# Altium schematic sheet 1.1.2_Interface_board_Power_Supply.SchDoc
size A4; DocumentNumber: 4; SheetNumber: 4; SheetTotal: 14
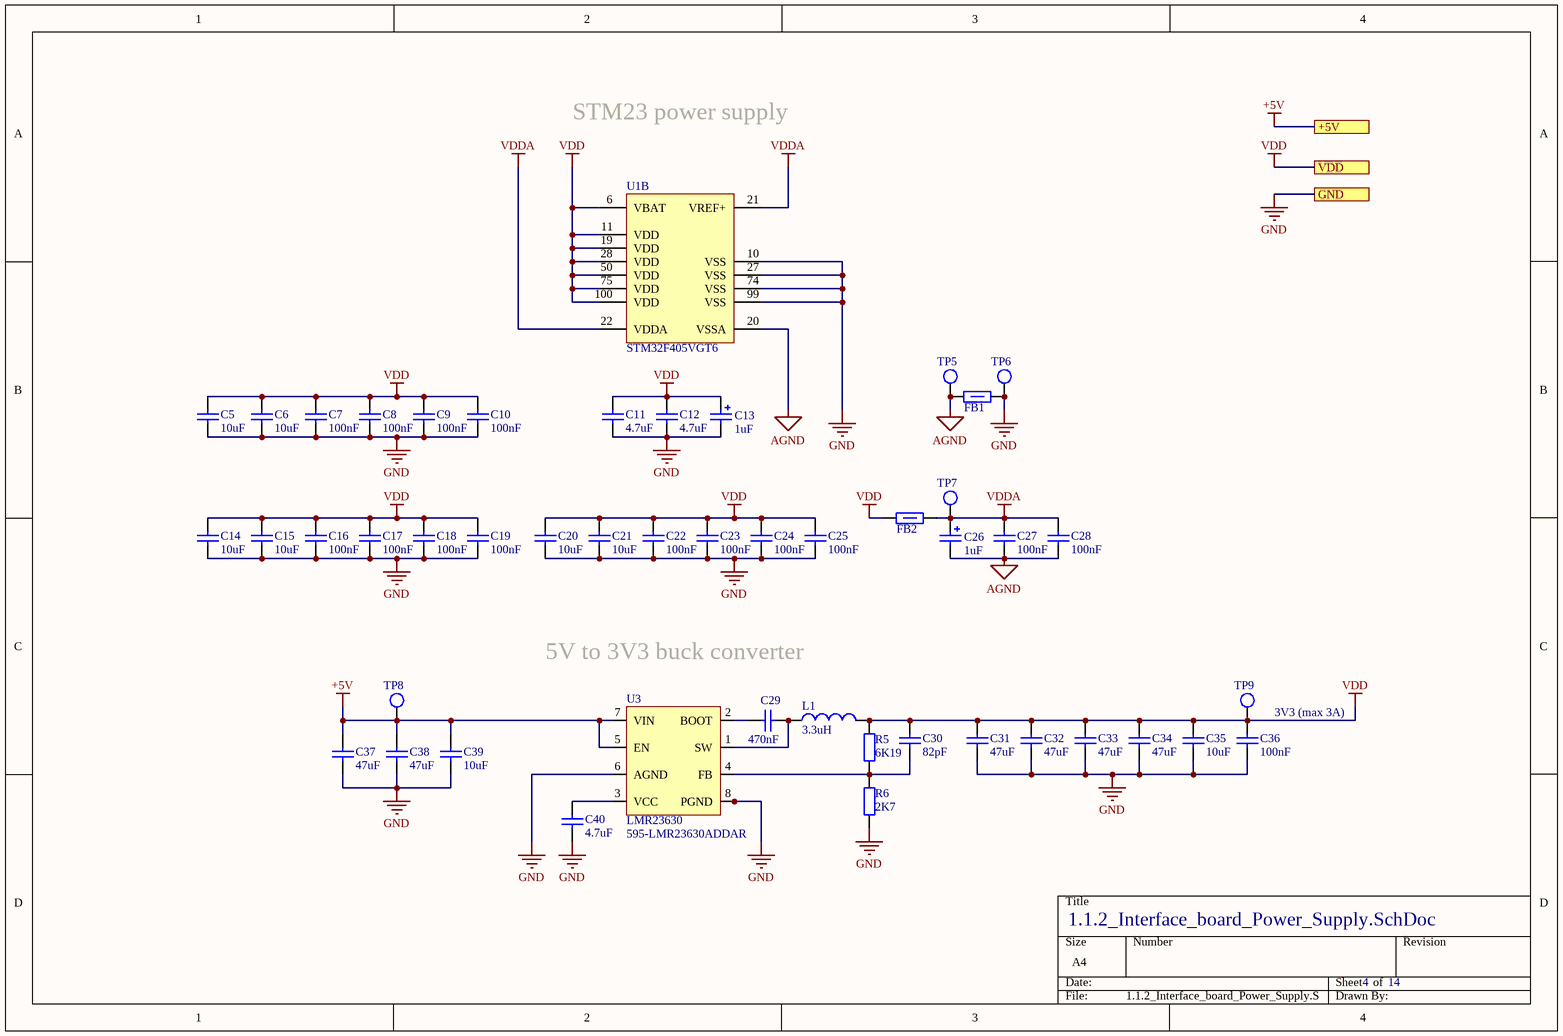
[diagram p0: 1.1.2_Interface_board_Power_Supply.SchDoc]

## Parts
C5  10uF  [CAP0805W]
C6  10uF  [CAP0805W]
C7  100nF  [CAP0603R]
C8  100nF  [CAP0603R]
C9  100nF  [CAP0603R]
C10  100nF  [CAP0603R]
C11  4.7uF  [CAP0805W]
C12  4.7uF  [CAP0805W]
C13  1uF  [CAP1206-case_A]
C14  10uF  [CAP0805W]
C15  10uF  [CAP0805W]
C16  100nF  [CAP0603R]
C17  100nF  [CAP0603R]
C18  100nF  [CAP0603R]
C19  100nF  [CAP0603R]
C20  10uF  [CAP0805W]
C21  10uF  [CAP0805W]
C22  100nF  [CAP0603R]
C23  100nF  [CAP0603R]
C24  100nF  [CAP0603R]
C25  100nF  [CAP0603R]
C26  1uF  [CAP1206-case_A]
C27  100nF  [CAP0603R]
C28  100nF  [CAP0603R]
C29  470nF  [CAP0603R]
C30  82pF  [CAP0603R]
C31  47uF  [CAP1206W]
C32  47uF  [CAP1206W]
C33  47uF  [CAP1206W]
C34  47uF  [CAP1206W]
C35  10uF  [CAP0805W]
C36  100nF  [CAP0603R]
C37  47uF  [CAP1206W]
C38  47uF  [CAP1206W]
C39  10uF  [CAP0805W]
C40  4.7uF  [CAP0805W]
FB1  81-BLM18KG601SZ1D  [0603]  (value not drawn)
FB2  81-BLM18KG601SZ1D  [0603]  (value not drawn)
L1  3.3uH  [IHLP-2525CZ-01_Inductor]
R5  6K19  [0603]
R6  2K7  [0603]
TP5  Test point  [TP]  (value not drawn)
TP6  Test point  [TP]  (value not drawn)
TP7  Test point  [TP]  (value not drawn)
TP8  Test point  [TP]  (value not drawn)
TP9  Test point  [TP]  (value not drawn)
U1  STM32F405VGT6  [STM-LQFP100_N]  (part B of 2)
U3  LMR23630  Supplier Part Number 1: 595-LMR23630ADDAR  [HSOIC-8]

## Ports
+5V, GND, VDD

## Nets
+5V: C37.2 C38.2 C39.2 TP8.1 U3.5(EN) U3.7(VIN) ; port +5V
AGND: C26.2 C27.1 C28.1 FB1.1 TP5.1 U1.20(VSSA)
GND: C5.1 C6.1 C7.1 C8.1 C9.1 C10.1 C11.1 C12.1 C13.2 C14.1 C15.1 C16.1 C17.1 C18.1 C19.1 C20.1 C21.1 C22.1 C23.1 C24.1 C25.1 C31.1 C32.1 C33.1 C34.1 C35.1 C36.1 C37.1 C38.1 C39.1 C40.1 FB1.2 R6.1 TP6.1 U1.10(VSS) U1.27(VSS) U1.74(VSS) U1.99(VSS) U3.6(AGND) U3.8(PGND) U3.PD(PGND) ; port GND
VDD: C5.2 C6.2 C7.2 C8.2 C9.2 C10.2 C11.2 C12.2 C13.1 C14.2 C15.2 C16.2 C17.2 C18.2 C19.2 C20.2 C21.2 C22.2 C23.2 C24.2 C25.2 C30.2 C31.2 C32.2 C33.2 C34.2 C35.2 C36.2 FB2.1 L1.2 R5.2 TP9.1 U1.6(VBAT) U1.11(VDD) U1.19(VDD) U1.28(VDD) U1.50(VDD) U1.75(VDD) U1.100(VDD) ; port VDD
VDDA: C26.1 C27.2 C28.2 FB2.2 TP7.1 U1.21(VREF+) U1.22(VDDA)
NetC29_1: C29.1 L1.1 U3.1(SW)
NetC29_2: C29.2 U3.2(BOOT)
NetC30_1: C30.1 R5.1 R6.2 U3.4(FB)
NetC40_2: C40.2 U3.3(VCC)

## Notes on the sheet
- STM23 power supply
- 5V to 3V3 buck converter
- 3V3 (max 3A)

## Library data of the parts
C5 C6 C14 C15 C20 C21 C35 C39 = C_10uF_16v: Capacitor; Supplier 1: Mouser; Supplier Part Number 1: 81-GRT21BC81C106ME1L
C7-C10 C16-C19 C22-C25 C27 C28 C36 = C_100nF: Capacitor; Supplier 1: Mouser; Supplier Part Number 1: 81-GCG188R91H104KA1D
C11 C12 = C_4.7uF: Capacitor; Supplier 1: Mouser; Supplier Part Number 1: 81-GCG21BR71C475KA2L
C13 C26 = C_pol_1uF_tental: Polarized Capacitor; Revision: July-2002: Re-released for DXP Platform.; Supplier 1: Mouser; Supplier Part Number 1: 581-TAJA105K016
C29 = C_470nF_25v: Capacitor; Supplier 1: Mouser; Supplier Part Number 1: 81-GRT188R61E474KE3D
C30 = C_82pF_50V: Capacitor; Supplier 1: Mouser; Supplier Part Number 1: 81-GCM1885C1H820JA6D
C31-C34 C37 C38 = C_47uF_25v_1206: Capacitor; Supplier 1: Mouser; Supplier Part Number 1: 810-C3216X5R1E476M
C40 = C_4.7uF_16v: Capacitor; Supplier 1: Mouser; Supplier Part Number 1: 81-GCG21BR71C475KA2L
FB1 FB2 = Ferrite_bead: Supplier 1: Mouser; Supplier Part Number 1: 81-BLM18KG601SZ1D
L1 = L_3.3uH_6A: Inductors 3.3uH 20%; Supplier 1: Mouser; Supplier Part Number 1: 70-IHLP2525CZER3R3M0
R5 = R_0603_01W_6K2: 0.1W 6K19; Supplier 1: Mouser; Supplier Part Number 1: 667-ERJ-3EKF6191V
R6 = R_0603_01W_2K7: 0.1W 2K7; Supplier 1: Mouser; Supplier Part Number 1: 667-ERJ-3EKF2701V
U1 = STM32F405VGT6: ARM Cortex-M4 32-bit MCU+FPU, 210 DMIPS, 1024 kB Flash, 192 kB Internal RAM, 82 I/Os, 100-pin LQFP, -40 to 85 degC, Tray; Manufacturer: STMicroelectronics; D/A Converter: 2x12-bit; FLASH Size (Prog) (kB): 1024; I/Os (High Current): 82; Internal RAM Size (kB): 192; Operating Frequency(F) (Processor speed) (MHz): 168; Supply Voltage(Vcc) max (V): 3.6; Supply Voltage(Vcc) min (V): 1.8; DatasheetVersion: Rev. 4; PackageVersion: Rev. 1, 06/2013; PackageReference: LQFP100; PackageDescription: 100-Pin Low Profile Quad Flat Package, 14 x 14 mm Body, 0.5 mm Pitch; Supplier 1: Digi-Key; Supplier Part Number 1: 497-11910-ND; Supplier 2: Farnell; Supplier Part Number 2: 2215224; Supplier 3: Newark; Supplier Part Number 3: 46W2199; Supplier 4: Newark; Supplier Part Number 4: 94T6493; Supplier 5: Mouser; Supplier Part Number 5: 511-STM32F405VGT6; Core: ARM Cortex-M4; Packing: Tray; Mounting Technology: Surface Mount; PartNumber: STM32F405VGT6; ComponentLink1Description: Manufacturer URL; ComponentLink1URL: http://www.st.com/web/en/home.html; ComponentLink2Description: Datasheet; ComponentLink2URL: http://www.st.com/st-web-ui/static/active/en/resource/technical/document/datasheet/DM00037051.pdf; ComponentLink3Description: Package Specification; ComponentLink3URL: http://www.st.com/st-web-ui/static/active/en/resource/technical/document/data_brief/DM00071938.pdf
U3 = LMR23630: Voltage regulator 3A; Supplier 1: Mouser